# EasyEDA Pro project EasyEDA_Pro_IP5355_ABCC V1.0.epro

# Schematic SCH_IP5355_ABCC V1.0
Create Date: 2024-04-27; Page Name: IP5355; Project Name: IP5355_ABCC V1.0; Schematic Name: SCH_IP5355_ABCC V1.0; Update Date: 2024-05-05; Company: PicoLabs; Drawn: Picomicro; Page Size: A4; Part Number: IP5355_ABCC; Reviewed: Picomicro; Version: V1.0
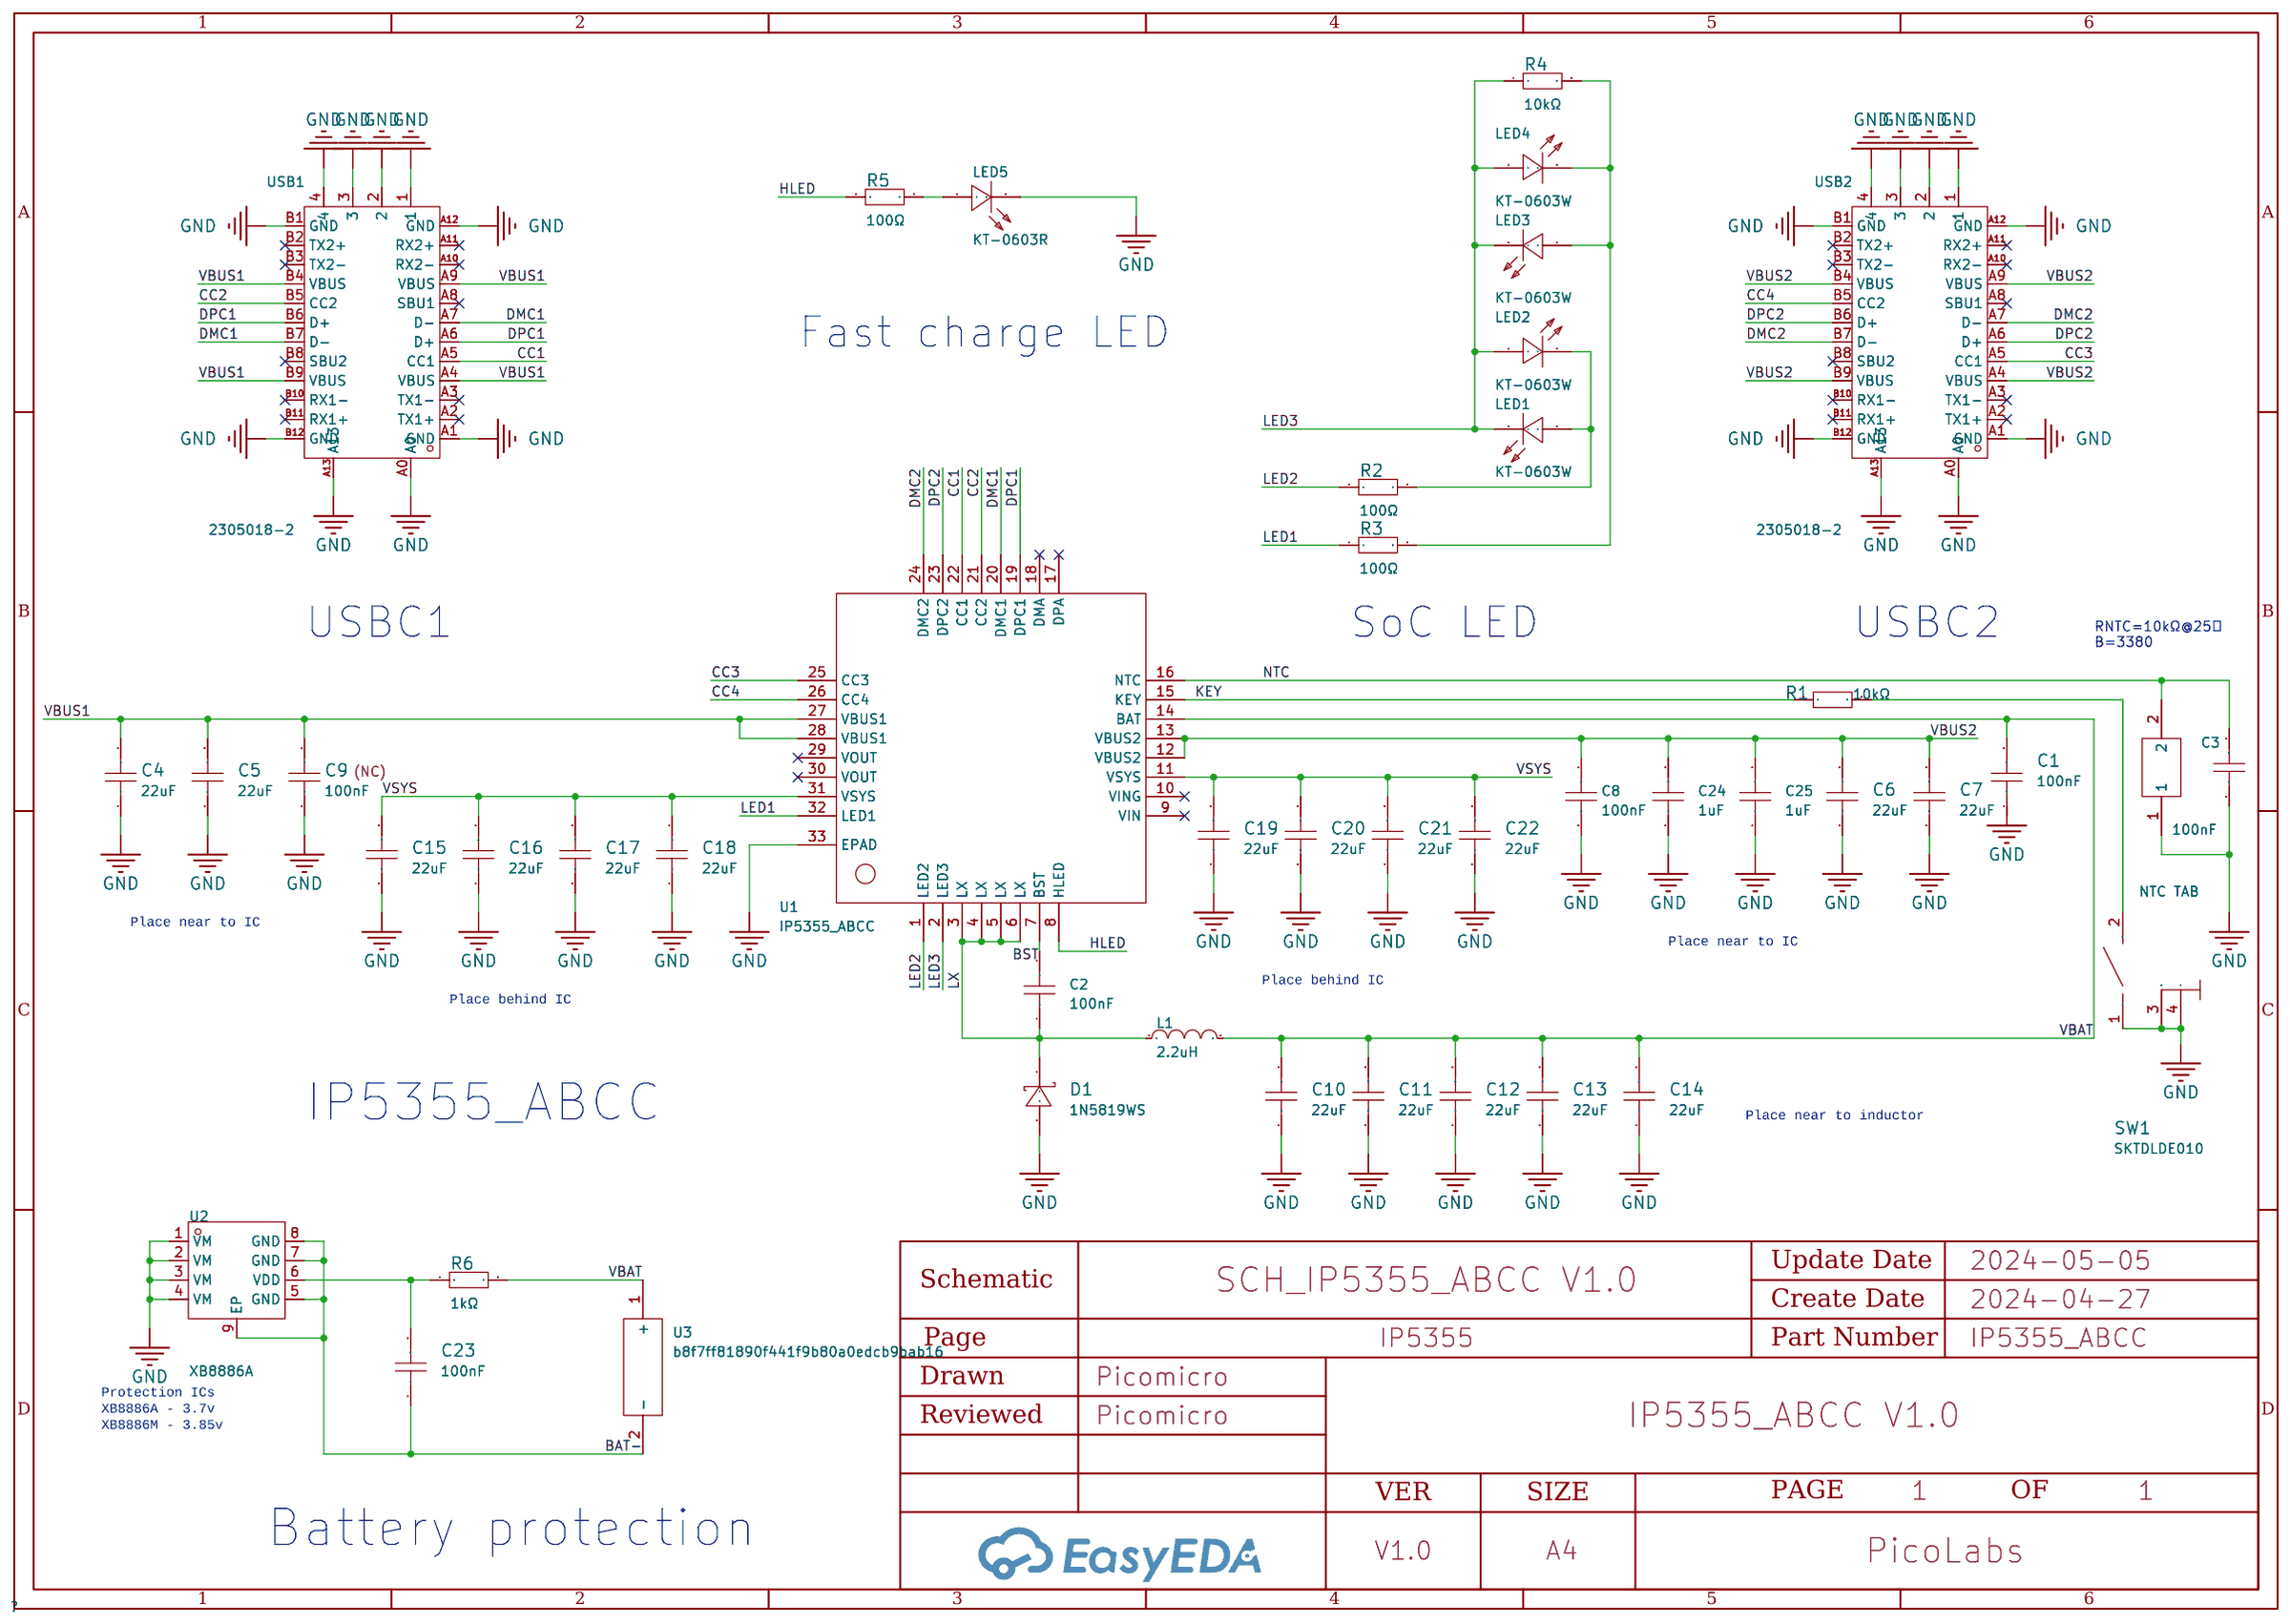
[diagram p0: schematic sheet]

## Parts
C1  100nF  [C0603]
C2  100nF  [C0402]
C3  100nF  [C0402]
C4  22uF  [C0805]
C5  22uF  [C0805]
C6  22uF  [C0805]
C7  22uF  [C0805]
C8  100nF  [C0402]
C9  100nF  [C0402]
C10  22uF  [C0805]
C11  22uF  [C0805]
C12  22uF  [C0805]
C13  22uF  [C0805]
C14  22uF  [C0805]
C15  22uF  [C0805]
C16  22uF  [C0805]
C17  22uF  [C0805]
C18  22uF  [C0805]
C19  22uF  [C0805]
C20  22uF  [C0805]
C21  22uF  [C0805]
C22  22uF  [C0805]
C23  100nF  [C0603]
C24  1uF  [C0402]
C25  1uF  [C0402]
CON1  NTC TAB  [NTC_connector]
D1  1N5819WS  [SOD-323_L1.8-W1.3-LS2.5-RD]
L1  2.2uH  [IND-SMD_L13.5-W12.6_125CDMCC-DS]
LED1  KT-0603W  [LED0603-R-RD_WHITE]
LED2  KT-0603W  [LED0603-R-RD_WHITE]
LED3  KT-0603W  [LED0603-R-RD_WHITE]
LED4  KT-0603W  [LED0603-R-RD_WHITE]
LED5  KT-0603R  [LED0603-RD]
R1  10kΩ  [R0402]
R2  100Ω  [R0402]
R3  100Ω  [R0402]
R4  10kΩ  [R0402]
R5  100Ω  [R0402]
R6  1kΩ  [R0603]
SW1  SKTDLDE010  [KEY-SMD_SKTDLDE010]
U1  IP5355_ABCC  [QFN-32_L5.0-W5.0-P0.50-TL-EP3.5_IP5355]
U2  XB8886A  [SOIC-8_L5.0-W4.0-P1.27-LS6.0-BL-EP2.0]
U3  b8f7ff81890f441f9b80a0edcb9bab16  [9858102 BAT TAB]
USB1  2305018-2  [USB-SMD_2305018-2]
USB2  2305018-2  [USB-SMD_2305018-2]

## Library data of the parts
C1 C23 = CC0603KRX7R9BB104: Capacitance: Tolerance:±10% Tolerance:±10% Voltage Rated: Temperature Coefficient:; LCSC Part Name: 100nF ±10% 50V; Supplier Part: C14663; Manufacturer: YAGEO(国巨); Supplier Footprint: 0603; JLCPCB Part Class: Basic Part; Datasheet: https://atta.szlcsc.com/upload/public/pdf/source/20180910/C282072_33301C7F631E79921B82A8DAC6BCC5B3.pdf; Supplier: LCSC; Tolerance: ±10%
C2 C3 C8 = CL05B104KB54PNC: Capacitance: Tolerance:±10% Tolerance:±10% Voltage Rated: Temperature Coefficient:; LCSC Part Name: 100nF ±10% 50V; Supplier Part: C307331; Manufacturer: SAMSUNG(三星); Supplier Footprint: 0402; JLCPCB Part Class: Basic Part; Datasheet: https://atta.szlcsc.com/upload/public/pdf/source/20160218/1457707763339.pdf; Supplier: LCSC; Tolerance: ±10%
C4-C7 C10-C22 = CL21A226MAQNNNE: Capacitance: Tolerance:±20% Tolerance:±20% Voltage Rated: Temperature Coefficient:; LCSC Part Name: 22uF ±20% 25V; Supplier Part: C45783; Manufacturer: SAMSUNG(三星); Supplier Footprint: 0805; JLCPCB Part Class: Basic Part; Datasheet: https://atta.szlcsc.com/upload/public/pdf/source/20160218/1457707763339.pdf; Supplier: LCSC; Tolerance: ±20%
C9 = CL05B104KB54PNC: Capacitance: Tolerance:±10% Tolerance:±10% Voltage Rated: Temperature Coefficient:; LCSC Part Name: 100nF ±10% 50V; Supplier Part: C307331; Manufacturer: SAMSUNG(三星); Supplier Footprint: 0402; JLCPCB Part Class: Basic Part; Datasheet: https://atta.szlcsc.com/upload/public/pdf/source/20160218/1457707763339.pdf; Supplier: LCSC; Tolerance: ±10%; Note: (NC)
C24 C25 = CL05A105KA5NQNC: Capacitance: Tolerance:±10% Tolerance:±10% Voltage Rated: Temperature Coefficient:; LCSC Part Name: 1uF ±10% 25V; Supplier Part: C52923; Manufacturer: SAMSUNG(三星); Supplier Footprint: 0402; JLCPCB Part Class: Basic Part; Datasheet: https://atta.szlcsc.com/upload/public/pdf/source/20160218/1457707763339.pdf; Supplier: LCSC; Tolerance: ±10%
CON1 = NTC_connector
D1 = 1N5819WS_C191023: Forward Voltage (Vf@If):600mV@1A Reverse Voltage (Vr):40V Average Rectified Current (Io):1A; LCSC Part Name: 电压:40V 电流:1A; Supplier Part: C191023; Manufacturer: Hottech(合科泰); Supplier Footprint: SOD-323; JLCPCB Part Class: Basic Part; Datasheet: https://atta.szlcsc.com/upload/public/pdf/source/20220428/3CB86FD8D28D653594B4E35F9D5AEFD9.pdf; Supplier: LCSC; Forward Voltage (Vf@If): 600mV@1A; Reverse Voltage (Vr): 40V; Average Rectified Current (Io): 1A
L1 = 125CDMCCDS-2R2MC: Inductance: Tolerance:±20% Tolerance:±20% Rated Current: Saturation Current (Isat):34A DC Resistance (DCR): Type:- Ratings:-; LCSC Part Name: 2.2uH ±20% 34A; Supplier Part: C2453932; Manufacturer: Sumida(胜美达); Supplier Footprint: SMD,13.5x12.6mm; JLCPCB Part Class: Extended Part; Datasheet: https://atta.szlcsc.com/upload/public/pdf/source/20210612/404793581B088B31FDAF89ACE8EE802D.pdf; Supplier: LCSC; Tolerance: ±20%; Saturation Current (Isat): 34A
LED1-LED4 = KT-0603W: Emitted Color:White; LCSC Part Name: 0603 白灯 高亮; Supplier Part: C2290; Manufacturer: KENTO; Supplier Footprint: 0603; JLCPCB Part Class: Basic Part; Datasheet: https://atta.szlcsc.com/upload/public/pdf/source/20221101/4C23D5C85BA051E44A00B833D0A41468.pdf; Supplier: LCSC; Emitted Color: White
LED5 = KT-0603R: Emitted Color:Red Power Dissipation:- Forward Current:- Dominant Wavelength:- Dominant Wavelength:- Peak Wavelength:- Diode Configuration:- Lens Color:- Color Temperature:- Color Temperature:- Viewing Angle:- Mounting Sytle:- Operating Temperature:-40℃~+8; LCSC Part Name: 0603 红灯 高亮; Supplier Part: C2286; Manufacturer: KENTO; Supplier Footprint: 0603; JLCPCB Part Class: Basic Part; Datasheet: https://atta.szlcsc.com/upload/public/pdf/source/20160616/1466072038404.pdf; Supplier: LCSC; Emitted Color: Red; Operating Temperature: -40℃~+85℃
R1 R4 = 0402WGF1002TCE: Type:Thick Film Resistors Resistance:10kΩ Tolerance:±1% Tolerance:±1% Power(Watts): Overload Voltage (Max): Temperature Coefficient:±100ppm/℃ Temperature Coefficient:±100ppm/℃ Operating Temperature Range:-55℃~+155℃ Operating Temperature Range:-55℃~+155℃; LCSC Part Name: 10kΩ ±1% 62.5mW 厚膜电阻; Supplier Part: C25744; Manufacturer: UNI-ROYAL(厚声); Supplier Footprint: 0402; JLCPCB Part Class: Basic Part; Datasheet: https://atta.szlcsc.com/upload/public/pdf/source/20200306/C422600_1E6D84923E4A46A82E41ADD87F860B5C.pdf; Supplier: LCSC; Type: Thick Film Resistors; Tolerance: ±1%; Temperature Coefficient: ±100ppm/℃; Operating Temperature Range: -55℃~+155℃
R2 R3 R5 = 0402WGF1000TCE: Type:Thick Film Resistors Resistance: Tolerance:±1% Tolerance:±1% Power(Watts): Overload Voltage (Max): Temperature Coefficient:±200ppm/℃ Temperature Coefficient:±200ppm/℃ Operating Temperature Range:-55℃~+155℃ Operating Temperature Range:-55℃~+155℃; LCSC Part Name: 100Ω ±1% 62.5mW 厚膜电阻; Supplier Part: C25076; Manufacturer: UNI-ROYAL(厚声); Supplier Footprint: 0402; JLCPCB Part Class: Basic Part; Datasheet: https://atta.szlcsc.com/upload/public/pdf/source/20200306/C422600_1E6D84923E4A46A82E41ADD87F860B5C.pdf; Supplier: LCSC; Type: Thick Film Resistors; Tolerance: ±1%; Temperature Coefficient: ±200ppm/℃; Operating Temperature Range: -55℃~+155℃
R6 = 0603WAF1001T5E: Type:Thick Film Resistors Resistance:1kΩ Tolerance:±1% Tolerance:±1% Power(Watts): Overload Voltage (Max): Temperature Coefficient:±100ppm/℃ Temperature Coefficient:±100ppm/℃ Operating Temperature Range:-55℃~+155℃ Operating Temperature Range:-55℃~+155℃; LCSC Part Name: 1kΩ ±1% 100mW 厚膜电阻; Supplier Part: C21190; Manufacturer: UNI-ROYAL(厚声); Supplier Footprint: 0603; JLCPCB Part Class: Basic Part; Datasheet: https://atta.szlcsc.com/upload/public/pdf/source/20200306/C422600_1E6D84923E4A46A82E41ADD87F860B5C.pdf; Supplier: LCSC; Type: Thick Film Resistors; Tolerance: ±1%; Temperature Coefficient: ±100ppm/℃; Operating Temperature Range: -55℃~+155℃
SW1 = SKTDLDE010: Circuit:SPST Actuator Style:Rectangle button Mounting Style:Lying Switch Length:3.9mm Switch Width:2.9mm Switch Height:1.55mm Contact Current:50mA Voltage Rating (DC):12V With Lamp:- Mechanical Life:-; LCSC Part Name: 3.9*2.9*1.55mm 卧插 轻触开关; Supplier Part: C115365; Manufacturer: ALPSALPINE(阿尔卑斯阿尔派); Supplier Footprint: 插件; JLCPCB Part Class: Extended Part; Datasheet: https://atta.szlcsc.com/upload/public/pdf/source/20170620/1497944818446.pdf; Supplier: LCSC; Circuit: SPST; Actuator Style: Rectangle button; Mounting Style: Lying; Switch Length: 3.9mm; Switch Width: 2.9mm; Switch Height: 1.55mm; Contact Current: 50mA; Voltage Rating (DC): 12V
U1 = IP5355_ABCC: Supplier: LCSC; Supplier Part: C9900092436; JLCPCB Part Class: Extended Part
U2 = XB8886A: Supplier Part: C669690; Manufacturer: xysemi(赛芯微); Supplier Footprint: SOIC-8-EP; JLCPCB Part Class: Extended Part; Datasheet: https://atta.szlcsc.com/upload/public/pdf/source/20200622/C669690_0063EAE3A52CEE4F89E3070819BC465F.pdf; Supplier: LCSC
U3 = 9858102 BAT TAB
USB1 USB2 = 2305018-2: Connector Type:Type-C Standard:USB 3.2 Gender:Female Number of Ports:1 Number of Contacts:24P Mounting Style:卧贴 Current Rating - Power (Max):- Operating Temperature Range:-40℃~+85℃ Operating Temperature Range:-40℃~+85℃; LCSC Part Name: Type-C 母 卧贴; Supplier Part: C498674; Manufacturer: TE Connectivity(泰科电子); Supplier Footprint: SMD; JLCPCB Part Class: Extended Part; Datasheet: https://atta.szlcsc.com/upload/public/pdf/source/20211230/A35CFB568880C0409940BD32CE432EFF.pdf; Supplier: LCSC; Connector Type: Type-C; Standard: USB 3.2; Gender: Female; Number of Ports: 1; Number of Contacts: 24P; Mounting Style: 卧贴; Operating Temperature Range: -40℃~+85℃

## Nets
GND: C1.1 C3.2 C4.1 C5.1 C6.1 C7.1 C8.2 C9.2 C10.1 C11.1 C12.1 C13.1 C14.1 C15.1 C16.1 C17.1 C18.1 C19.1 C20.1 C21.1 C22.1 C24.1 C25.1 CON1.1 D1.2(A) LED5.1(K) SW1.1 SW1.3 SW1.4 U1.33(EPAD) U2.1(VM) U2.2(VM) U2.3(VM) U2.4(VM) USB1.1 USB1.2 USB1.3 USB1.4 USB1.A0 USB1.A1(GND) USB1.A12(GND) USB1.A13 USB1.B1(GND) USB1.B12(GND) USB2.1 USB2.2 USB2.3 USB2.4 USB2.A0 USB2.A1(GND) USB2.A12(GND) USB2.A13 USB2.B1(GND) USB2.B12(GND)
VBAT: C1.2 C10.2 C11.2 C12.2 C13.2 C14.2 L1.2 R6.2 U1.14(BAT) U3.1(+)
VBUS1: C4.2 C5.2 C9.1 U1.27(VBUS1) U1.28(VBUS1) USB1.A4(VBUS) USB1.A9(VBUS) USB1.B4(VBUS) USB1.B9(VBUS)
VBUS2: C6.2 C7.2 C8.1 C24.2 C25.2 U1.12(VBUS2) U1.13(VBUS2) USB2.A4(VBUS) USB2.A9(VBUS) USB2.B4(VBUS) USB2.B9(VBUS)
BAT-: C23.1 U2.5(GND) U2.7(GND) U2.8(GND) U2.9(EP) U3.2(-)
BST: C2.2 U1.7(BST)
CC1: U1.22(CC1) USB1.A5(CC1)
CC2: U1.21(CC2) USB1.B5(CC2)
CC3: U1.25(CC3) USB2.A5(CC1)
CC4: U1.26(CC4) USB2.B5(CC2)
DMC1: U1.20(DMC1) USB1.A7(D-) USB1.B7(D-)
DMC2: U1.24(DMC2) USB2.A7(D-) USB2.B7(D-)
DPC1: U1.19(DPC1) USB1.A6(D+) USB1.B6(D+)
DPC2: U1.23(DPC2) USB2.A6(D+) USB2.B6(D+)
HLED: R5.1 U1.8(HLED)
KEY: R1.1 U1.15(KEY)
LED1: R3.1 U1.32(LED1)
LED2: R2.1 U1.1(LED2)
LED3: LED1.2(K) LED2.1(A) LED3.2(K) LED4.1(A) R4.1 U1.2(LED3)
LX: C2.1 D1.1(K) L1.1 U1.3(LX) U1.4(LX) U1.5(LX) U1.6(LX)
NTC: C3.1 CON1.2 U1.16(NTC)
VSYS: C15.2 C16.2 C17.2 C18.2 C19.2 C20.2 C21.2 C22.2 U1.11(VSYS) U1.31(VSYS)
$1N4792: R1.2 SW1.2
$1N5160: LED1.1(A) LED2.2(K) R2.2
$1N5318: LED3.1(A) LED4.2(K) R3.2 R4.2
$1N5487: C23.2 R6.1 U2.6(VDD)
$1N6588: LED5.2(A) R5.2

Not connected (* = marked no-connect by the designer): U1 9(VIN)* 10(VING)* 17(DPA)* 18(DMA)* 29(VOUT)* 30(VOUT)*; USB1 A2(TX1+)* A3(TX1-)* A8(SBU1)* A10(RX2-)* A11(RX2+)* B2(TX2+)* B3(TX2-)* B8(SBU2)* B10(RX1-)* B11(RX1+)*; USB2 A2(TX1+)* A3(TX1-)* A8(SBU1)* A10(RX2-)* A11(RX2+)* B2(TX2+)* B3(TX2-)* B8(SBU2)* B10(RX1-)* B11(RX1+)*

## Notes on the sheet
- Fast charge LED
- USBC1
- SoC LED
- USBC2
- RNTC=10kΩ@25℃
  B=3380
- Place near to IC
- Place near to IC
- Place behind IC
- Place behind IC
- IP5355_ABCC
- Place near to inductor
- Protection ICs
  XB8886A - 3.7v
  XB8886M - 3.85v
- Battery protection

# Board PCB_IP5355_ABCC V1.0
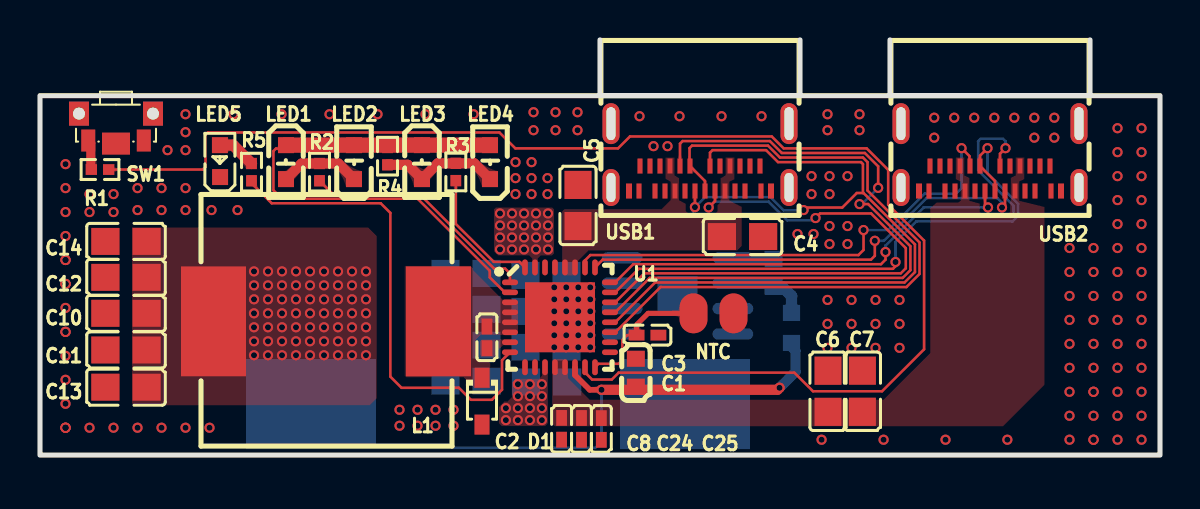
[diagram p1: board, top side]
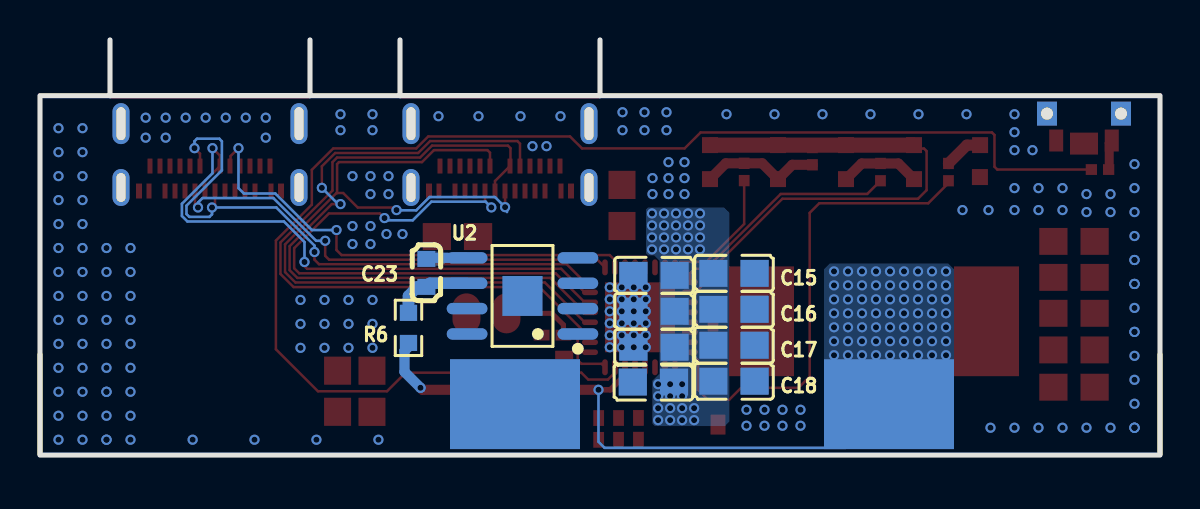
[diagram p2: board, bottom side, seen from below]

Outline 56 x 20.79 mm; copper layers: Top Layer, Inner1, Inner2, Bottom Layer. Coordinates in mm from the lower left corner of the outline.
Outline path: rectangle 0,18 56,0
Stack: Top Layer 0.035mm 外层铜厚1oz / Dielectric1 0.2104mm 7628 RC49% 8.6mil / Inner1 0.0152mm 内层铜厚 / Dielectric2 1.065mm 1.1mm H/HOZ 含铜 / Inner2 0.0152mm 内层铜厚 / Dielectric3 0.2104mm 7628 RC49% 8.6mil / Bottom Layer 0.035mm 外层铜厚1oz

## Design rules (mm)
template: Custom Config
spacing copperThickness1oz (default): track to track 0.102, other pairs 0.152 to 0.3
spacing copperThickness2oz: track to track 0.203, other pairs 0.152 to 0.3
track width copperThickness1oz (default): min 0.127, default 0.254, max 2.54
track width copperThickness2oz: min 0.203, default 0.254, max 2.54
differential pair differentialPair (default): width min 0.127, default 0.254, max 2.54; gap min 0.152, default 0.152
via viaSize (default): diameter min 0.5, default 0.61, max 10; hole min 0.3, default 0.305, max 6.3

## Placement (name value [footprint] x y rotation side)
C1  100nF  [C0603]  29.79 4.12 270 top
C2  100nF  [C0402]  22.34 5.9 270 top
C3  100nF  [C0402]  30.37 6.01 0 top
C4  22uF  [C0805]  35.13 10.94 180 top
C5  22uF  [C0805]  26.9 12.5 270 top
C6  22uF  [C0805]  39.4 3.19 270 top
C7  22uF  [C0805]  41.12 3.2 270 top
C8  100nF  [C0402]  26.08 1.32 270 top
C10  22uF  [C0805]  4.3 7.1 0 top
C11  22uF  [C0805]  4.3 5.27 0 top
C12  22uF  [C0805]  4.3 8.9 0 top
C13  22uF  [C0805]  4.3 3.4 0 top
C14  22uF  [C0805]  4.3 10.7 0 top
C15  22uF  [C0805]  21.3 9.1 0 bottom
C16  22uF  [C0805]  21.3 7.3 0 bottom
C17  22uF  [C0805]  21.3 5.5 0 bottom
C18  22uF  [C0805]  21.3 3.7 0 bottom
C19  22uF  [C0805]  25.33 3.66 180 bottom
C20  22uF  [C0805]  25.3 5.4 180 bottom
C21  22uF  [C0805]  25.3 7.2 180 bottom
C22  22uF  [C0805]  25.3 9 180 bottom
C23  100nF  [C0603]  36.68 9.12 270 bottom
C24  1uF  [C0402]  27.07 1.31 90 top
C25  1uF  [C0402]  28.07 1.31 90 top
D1  1N5819WS  [SOD-323_L1.8-W1.3-LS2.5-RD]  22.1 2.7 270 top
L1  2.2uH  [IND-SMD_L13.5-W12.6_125CDMCC-DS]  14.3 6.7 180 top
LED1  KT-0603W  [LED0603-R-RD_WHITE]  12.3 14.67 270 top
LED2  KT-0603W  [LED0603-R-RD_WHITE]  15.7 14.67 90 top
LED3  KT-0603W  [LED0603-R-RD_WHITE]  19.1 14.67 270 top
LED4  KT-0603W  [LED0603-R-RD_WHITE]  22.5 14.67 90 top
LED5  KT-0603R  [LED0603-RD]  9 14.72 90 top
NTC  NTC TAB  [NTC_connector]  33.68 7.1 180 top
R1  10kΩ  [R0402]  3 14.3 180 top
R2  100Ω  [R0402]  13.98 14.17 90 top
R3  100Ω  [R0402]  20.79 14.18 90 top
R4  10kΩ  [R0402]  17.38 14.97 270 top
R5  100Ω  [R0402]  10.58 14.17 90 top
R6  1kΩ  [R0603]  37.58 6.37 270 bottom
SW1  SKTDLDE010  [KEY-SMD_SKTDLDE010]  3.8 16.35 0 top
U1  IP5355_ABCC  [QFN-32_L5.0-W5.0-P0.50-TL-EP3.5_IP5355]  26 6.9 0 top
U2  XB8886A  [SOIC-8_L5.0-W4.0-P1.27-LS6.0-BL-EP2.0]  31.88 7.97 90 bottom
U3  b8f7ff81890f441f9b80a0edcb9bab16  [9858102 BAT TAB]  56 2.55 180 bottom
USB1  2305018-2  [USB-SMD_2305018-2]  33 14.91 180 top
USB2  2305018-2  [USB-SMD_2305018-2]  47.5 14.91 180 top

## Footprints (pads in the part's own frame, mm; a bottom-side part is the same pattern mirrored in y, then rotated)
9858102 BAT TAB
  rect 6.5x4.5 smd: 1(42.45,0) 2(23.75,0)
C0402
  rect 0.79x0.54 smd: 1(-0.545,0) 2(0.545,0)
C0603
  rect 0.8x0.9 smd: 1(-0.7,0) 2(0.7,0)
C0805
  rect 1.41x1.35 smd: 1(-1.03,0) 2(1.03,0)
IND-SMD_L13.5-W12.6_125CDMCC-DS
  rect 3.25x5.5 smd: 1(-5.625,0) 2(5.625,0)
KEY-SMD_SKTDLDE010
  rect 0.7x1.1 smd: 1(1.391,-0.597) 2(-1.388,-0.597)
  rect 1.4x1.1 smd: 3(0,-0.75)
  rect 1x1.2 hole 0.6: 4(-1.85,0.75) 4(1.85,0.75)
LED0603-R-RD_WHITE
  rect 0.8x0.8 smd: 1(0.851,0) 2(-0.851,0)
LED0603-RD
  rect 0.8x0.8 smd: 1(-0.799,-0.004) 2(0.799,0.004)
NTC_connector
  oval 1.4x2 smd: 1(-1,0) 2(1,0)
QFN-32_L5.0-W5.0-P0.50-TL-EP3.5_IP5355
  oval 0.8x0.28 smd: 1(-2.5,1.75) 2(-2.5,1.25) 3(-2.5,0.75) 4(-2.5,0.25) 5(-2.5,-0.25) 6(-2.5,-0.75) 7(-2.5,-1.25) 8(-2.5,-1.75) 17(2.5,-1.75) 18(2.5,-1.25) 19(2.5,-0.75) 20(2.5,-0.25) 21(2.5,0.25) 22(2.5,0.75) 23(2.5,1.25) 24(2.5,1.75)
  oval 0.28x0.8 smd: 9(-1.75,-2.5) 10(-1.25,-2.5) 11(-0.75,-2.5) 12(-0.25,-2.5) 13(0.25,-2.5) 14(0.75,-2.5) 15(1.25,-2.5) 16(1.75,-2.5) 25(1.75,2.5) 26(1.25,2.5) 27(0.75,2.5) 28(0.25,2.5) 29(-0.25,2.5) 30(-0.75,2.5) 31(-1.25,2.5) 32(-1.75,2.5)
  rect 3.5x3.5 smd: 33(0,0)
R0402
  rect 0.566x0.54 smd: 1(-0.433,0) 2(0.433,0)
R0603
  rect 0.806x0.864 smd: 1(-0.753,0) 2(0.753,0)
SOD-323_L1.8-W1.3-LS2.5-RD
  rect 1x0.75 smd: 1(-1.173,0) 2(1.173,0)
SOIC-8_L5.0-W4.0-P1.27-LS6.0-BL-EP2.0
  oval 0.574x2.038 smd: 1(-1.905,-2.769) 2(-0.635,-2.769) 3(0.635,-2.769) 4(1.905,-2.769) 5(1.905,2.769) 6(0.635,2.769) 7(-0.635,2.769) 8(-1.905,2.769)
  rect 2x2 smd: 9(0,0)
USB-SMD_2305018-2
  oval 0.85x1.85 hole 0.45x1.45: 1(-4.45,1.512) 2(4.45,1.512)
  oval 0.85x2.05 hole 0.45x1.65: 3(-4.45,-1.688) 4(4.45,-1.687)
  rect 0.3x0.75 smd: A0(-3.55,1.688) A13(3.55,1.688)
  rect 0.25x0.75 smd: A1(-3.05,1.688) A2(-2.25,1.688) A3(-1.75,1.688) A4(-1.25,1.688) A5(-0.75,1.688) A6(-0.25,1.688) A7(0.25,1.688) A8(0.75,1.688) A9(1.25,1.688) A10(1.75,1.688) A11(2.25,1.688) A12(3.05,1.688) B1(3,0.438) B2(2.5,0.438) B3(2,0.438) B4(1.5,0.438) B5(1,0.438) B6(0.5,0.438) B7(-0.5,0.438) B8(-1,0.438) B9(-1.5,0.438) B10(-2,0.438) B11(-2.5,0.438) B12(-3,0.438)

## Nets
As in the schematic, except:
GND: C1.1 C3.2 C4.1 C5.1 C6.1 C7.1 C8.2 C10.1 C11.1 C12.1 C13.1 C14.1 C15.1 C16.1 C17.1 C18.1 C19.1 C20.1 C21.1 C22.1 C24.1 C25.1 D1.2 LED5.1 NTC.1 SW1.1 SW1.3 SW1.4 U1.33 U2.1 U2.2 U2.3 U2.4 USB1.1 USB1.2 USB1.3 USB1.4 USB1.A0 USB1.A1 USB1.A12 USB1.A13 USB1.B1 USB1.B12 USB2.1 USB2.2 USB2.3 USB2.4 USB2.A0 USB2.A1 USB2.A12 USB2.A13 USB2.B1 USB2.B12
NTC: C3.1 NTC.2 U1.16

Pads without a net: U1 9 10 17 18 29 30; USB1 A2 A3 A8 A10 A11 B2 B3 B8 B10 B11; USB2 A2 A3 A8 A10 A11 B2 B3 B8 B10 B11

## Via types
v1: diameter 0.51, hole 0.305, Top Layer to Bottom Layer, 301 vias

## Routing (per net, layer and track width the routed paths; a pad name or vN(x,y) marks a point on that pad's centre or on a via; arc(x,y) is an arc through that point)
GND:
  vias: v1(1.28,14.57) v1(1.28,13.37) v1(1.28,12.17) v1(1.28,10.97) v1(1.28,9.77) v1(1.28,9.77) v1(1.28,8.57) v1(1.28,8.57) v1(1.28,8.57) v1(1.28,7.37) v1(1.28,6.17) v1(1.28,6.17) v1(1.28,4.97) v1(1.28,3.77) v1(1.28,2.57) v1(1.28,1.37) v1(1.28,1.37) v1(1.28,1.37) v1(2.48,13.07) v1(2.48,12.17) v1(2.48,1.37) v1(3.68,13.07) v1(3.68,12.17) v1(3.68,1.37) v1(4.88,13.37) v1(4.88,12.27) v1(4.88,1.37) v1(6.08,13.37) v1(6.08,12.27) v1(6.08,1.37) v1(6.38,15.27) v1(7.28,17.07) v1(7.28,16.17) v1(7.28,15.27) v1(7.28,13.37) v1(7.28,12.27) v1(7.28,1.37) v1(8.48,1.37) v1(8.58,12.27) v1(9.68,17.07) v1(9.88,12.27) v1(12.08,17.07) v1(14.48,17.07) v1(16.88,17.07) v1(17.98,2.27) v1(17.98,1.47) v1(18.88,2.27) v1(18.88,1.47) v1(19.28,17.07) v1(19.78,2.27) v1(19.78,1.47) v1(20.68,2.27) v1(20.68,1.47) v1(21.68,17.07) v1(23.78,14.67) v1(23.78,13.87) v1(23.78,13.07) v1(24.58,14.67) v1(24.58,13.87) v1(24.58,13.07) v1(24.68,17.17) v1(24.68,16.27) v1(25.38,13.87) v1(25.38,13.07) v1(25.71,8.4) v1(25.71,7.8) v1(25.71,7.2) v1(25.71,6.6) v1(25.71,6) v1(25.71,5.4) v1(25.78,17.17) v1(25.78,16.27) v1(26.31,8.4) v1(26.31,7.8) v1(26.31,7.2) v1(26.31,6.6) v1(26.31,6) v1(26.31,5.4) v1(26.88,17.17) v1(26.88,16.27) v1(26.91,8.4) v1(26.91,7.8) v1(26.91,7.2) v1(26.91,6.6) v1(26.91,6) v1(26.91,5.4) v1(27.51,8.4) v1(27.51,7.8) v1(27.51,7.2) v1(27.51,6.6) v1(27.51,6) v1(27.51,5.4) v1(29.98,16.97) v1(30.68,15.47) v1(31.38,15.47) v1(31.98,16.97) v1(34.08,16.97) v1(36.08,16.97) v1(37.88,11.07) v1(38.58,13.97) v1(38.58,13.07) v1(38.68,11.07) v1(39.08,0.77) v1(39.38,17.07) v1(39.38,16.27) v1(39.38,7.77) v1(39.38,6.57) v1(39.38,5.37) v1(39.48,13.97) v1(39.48,13.07) v1(39.48,11.47) v1(39.48,10.57) v1(40.38,13.97) v1(40.38,11.47) v1(40.38,10.57) v1(40.58,7.77) v1(40.58,6.57) v1(40.58,5.37) v1(40.98,17.07) v1(40.98,16.27) v1(41.78,7.77) v1(41.78,6.57) v1(41.78,5.37) v1(42.18,0.77) v1(42.98,7.77) v1(42.98,6.57) v1(42.98,5.37) v1(44.71,16.9) v1(44.71,15.9) v1(45.28,0.77) v1(45.71,16.9) v1(46.71,16.9) v1(47.72,16.9) v1(48.37,0.77) v1(48.72,16.9) v1(49.72,16.9) v1(49.72,15.9) v1(50.72,16.9) v1(50.72,15.9) v1(51.48,10.37) v1(51.48,9.17) v1(51.48,7.97) v1(51.48,6.77) v1(51.48,5.57) v1(51.48,4.37) v1(51.48,3.17) v1(51.48,1.97) v1(51.48,0.77) v1(52.68,10.37) v1(52.68,9.17) v1(52.68,7.97) v1(52.68,6.77) v1(52.68,5.57) v1(52.68,4.37) v1(52.68,3.17) v1(52.68,3.17) v1(52.68,1.97) v1(52.68,0.77) v1(52.68,0.77) v1(53.88,16.37) v1(53.88,15.17) v1(53.88,13.97) v1(53.88,12.77) v1(53.88,11.57) v1(53.88,10.37) v1(53.88,9.17) v1(53.88,7.97) v1(53.88,6.77) v1(53.88,5.57) v1(53.88,4.37) v1(53.88,3.17) v1(53.88,1.97) v1(53.88,0.77) v1(55.08,16.37) v1(55.08,15.17) v1(55.08,13.97) v1(55.08,12.77) v1(55.08,11.57) v1(55.08,10.37) v1(55.08,9.17) v1(55.08,7.97) v1(55.08,6.77) v1(55.08,5.57) v1(55.08,4.37) v1(55.08,3.17) v1(55.08,1.97) v1(55.08,0.77)
VBAT: length 31.7
  Top Layer w0.28: U1.14 26.75,4 27.49,3.27 v1(28.08,3.27)
  Top Layer w0.508: v1(36.98,3.37) 36.88,3.27 v1(28.08,3.27)
  Bottom Layer w0.127: v1(28.08,3.27) 28.08,0.67 27.77,0.36 15.74,0.36 U3.1
  Bottom Layer w0.508: 37.48,5.52 37.78,5.22 37.78,4.17 v1(36.98,3.37)
  vias: v1(10.7,9.2) v1(10.7,8.5) v1(10.7,7.8) v1(10.7,7.1) v1(10.7,6.4) v1(10.7,5.7) v1(10.7,5) v1(11.4,9.2) v1(11.4,8.5) v1(11.4,7.8) v1(11.4,7.1) v1(11.4,6.4) v1(11.4,5.7) v1(11.4,5) v1(12.1,9.2) v1(12.1,8.5) v1(12.1,7.8) v1(12.1,7.1) v1(12.1,6.4) v1(12.1,5.7) v1(12.1,5) v1(12.8,9.2) v1(12.8,8.5) v1(12.8,7.8) v1(12.8,7.1) v1(12.8,6.4) v1(12.8,5.7) v1(12.8,5) v1(13.5,9.2) v1(13.5,8.5) v1(13.5,7.8) v1(13.5,7.1) v1(13.5,6.4) v1(13.5,5.7) v1(13.5,5) v1(14.2,9.2) v1(14.2,8.5) v1(14.2,7.8) v1(14.2,7.1) v1(14.2,6.4) v1(14.2,5.7) v1(14.2,5) v1(14.9,9.2) v1(14.9,8.5) v1(14.9,7.8) v1(14.9,7.1) v1(14.9,6.4) v1(14.9,5.7) v1(14.9,5) v1(15.6,9.2) v1(15.6,8.5) v1(15.6,7.8) v1(15.6,7.1) v1(15.6,6.4) v1(15.6,5.7) v1(15.6,5) v1(16.3,9.2) v1(16.3,8.5) v1(16.3,7.8) v1(16.3,7.1) v1(16.3,6.4) v1(16.3,5.7) v1(16.3,5)
VBUS1: length 0.3
  Top Layer w0.127: C5.2 26.69,11.69
BAT-: length 2.1
  Bottom Layer w0.508: 36.68,9.77 36.57,9.88 U2.5
CC1: length 28.7
  Top Layer w0.127: v1(33.43,12.4) 33.75,12.72 USB1.A5 ; v1(38.78,11.87) 39,12.1 41.56,12.1 43.29,10.36 43.29,9.35 43.04,9.1 30.22,9.1 28.76,7.65 U1.22
  Bottom Layer w0.127: v1(38.78,11.87) 38.66,11.76 37.36,11.76 36.43,12.69 33.72,12.69 v1(33.43,12.4)
CC2: length 34.5
  Top Layer w0.127: U1.21 28.76,7.15 30.49,8.87 43.13,8.87 43.52,9.26 43.52,10.46 41.41,12.57 v1(40.98,12.57) ; USB1.B5 32,15.59 32.13,15.73 36.49,15.73 37.09,15.13 41.24,15.13 41.91,14.46 v1(41.91,13.38)
  Bottom Layer w0.127: v1(41.91,13.38) 41.09,12.57 v1(40.98,12.57)
CC3: length 23.5
  Top Layer w0.127: U1.25 28.14,9.79 41.55,9.79 41.74,9.98 v1(41.74,10.73) ; v1(48.1,12.4) 48.25,12.55 USB2.A5
  Bottom Layer w0.127: v1(48.1,12.4) 48.1,12.65 47.88,12.87 44.33,12.87 42.19,10.73 v1(41.74,10.73)
CC4: length 24.1
  Top Layer w0.127: 46.47,14.68 46.47,14.97 v1(46.08,15.37) ; v1(41.18,11.27) 41.18,10.27 40.92,10.02 27.52,10.02 27.25,9.75 U1.26
  Bottom Layer w0.127: v1(46.08,15.37) 46.08,13.37 45.8,13.1 44.23,13.1 42.41,11.27 v1(41.18,11.27)
DMC1: length 41.8
  Top Layer w0.127: USB1.B7 33.5,15.14 33.63,15.27 36.3,15.27 36.9,14.67 41.05,14.67 41.15,14.58 41.15,13.12 ; v1(32.75,12.42) 32.75,13.22 USB1.A7 ; 41.15,13.12 41.18,13.12 43.75,10.55 43.75,9.16 43.23,8.64 30.76,8.64 28.76,6.65 U1.20 ; 41.15,13.12 40.84,13.12 40.11,12.4 38.3,12.4 v1(38.18,12.27)
  Bottom Layer w0.127: 32.65,12.17 32.65,12.32 v1(32.75,12.42) 33.25,12.92 36.52,12.92 37.18,12.26 38.16,12.26 v1(38.18,12.27)
DMC2: length 30.7
  Top Layer w0.127: USB2.A7 47.25,12.55 v1(47.4,12.4) ; U1.24 28.76,8.65 29.66,9.56 42.05,9.56 42.28,9.79 v1(42.28,10.17) ; USB2.B7 48,15.09 v1(48.28,15.37)
  Bottom Layer w0.127: v1(48.28,15.37) 48.28,15.72 48.15,15.84 47.03,15.84 46.91,15.71 46.91,14.26 48.68,12.49 48.68,12.07 48.53,11.93 47.53,11.93 47.4,12.06 v1(47.4,12.4) 44.18,12.4 42.28,10.49 v1(42.28,10.17)
DPC1: length 35.3
  Top Layer w0.127: USB1.A6 33.25,13.72 USB1.B6 ; 32.49,14.35 32.48,14.36 32.48,15.37 32.6,15.5 36.4,15.5 37,14.9 41.15,14.9 41.38,14.67 41.38,13.25 43.98,10.65 43.98,9.07 43.32,8.42 31.03,8.42 28.76,6.15 U1.19
DPC2: length 29.2
  Top Layer w0.127: 47,14.64 47,14.99 v1(47.38,15.37) ; USB2.B6 47.75,13.72 USB2.A6 ; v1(42.78,9.67) 42.78,9.46 42.65,9.33 29.94,9.33 28.76,8.15 U1.23
  Bottom Layer w0.127: v1(47.38,15.37) 47.38,14.11 48.9,12.58 48.9,11.97 48.63,11.7 43.81,11.7 42.78,10.67 v1(42.78,9.67)
HLED: length 24.2
  Top Layer w0.127: U1.8 23.1,4.75 23.1,3.27 22.6,2.77 21.54,2.77 20.94,3.37 18.08,3.37 17.52,3.93 17.52,12.13 17.04,12.61 11.59,12.61 10.58,13.62 R5.1
KEY: length 70.4
  Top Layer w0.127: U1.15 27.25,4.14 27.6,3.78 28.59,3.78 28.93,4.13 37.72,4.13 38.65,3.2 42.1,3.2 44.2,5.3 44.2,10.74 42.41,12.54 42.41,14.28 41.33,15.36 37.18,15.36 36.59,15.96 29.5,15.96 28.9,15.36 23.77,15.36 22.97,16.16 8.4,16.16 8.28,16.03 8.28,14.44 8.14,14.3 R1.1
LED1: length 6.5
  Top Layer w0.127: U1.32 23.97,9.67 22.69,9.67 20.79,11.57 R3.1
LED2: length 11.9
  Top Layer w0.127: U1.1 23.5,9.1 23.25,9.34 22.7,9.34 18.96,13.08 14.64,13.08 R2.1
LED3: length 27.1
  Top Layer w0.127: LED1.2 12.13,15.35 11.8,15.35 11.67,15.22 11.67,13.27 12.1,12.84 18.88,12.84 22.49,9.23 22.49,8.9 23.24,8.15 U1.2
  Top Layer w0.76: LED4.1 LED3.2 LED2.1 LED1.2
NTC: length 6.6
  Top Layer w0.127: C3.1 29.36,6.01 29.12,5.77 29.12,4.76 28.93,4.57 27.92,4.57 U1.16
  Top Layer w0.254: 32.38,7.1 30.4,7.1 29.83,6.52 C3.1
VSYS:
  vias: v1(23,12.1) v1(23,11.5) v1(23,10.9) v1(23,10.3) v1(23.29,2.35) v1(23.29,1.75) v1(23.6,12.1) v1(23.6,11.5) v1(23.6,10.9) v1(23.6,10.3) v1(23.89,3.55) v1(23.89,2.95) v1(23.89,2.35) v1(23.89,1.75) v1(24.2,12.1) v1(24.2,11.5) v1(24.2,10.9) v1(24.2,10.3) v1(24.49,3.55) v1(24.49,2.95) v1(24.49,2.35) v1(24.49,1.75) v1(24.8,12.1) v1(24.8,11.5) v1(24.8,10.9) v1(24.8,10.3) v1(25.09,3.55) v1(25.09,2.95) v1(25.09,2.35) v1(25.09,1.75) v1(25.4,12.1) v1(25.4,11.5) v1(25.4,10.9) v1(25.4,10.3)
$1N4792: length 1.5
  Top Layer w0.45: R1.2 2.54,14.33 2.54,15.63 SW1.2
$1N5160: length 4
  Top Layer w0.51: LED2.2 14.92,14.6 13.08,14.6 LED1.1
$1N5318: length 6.1
  Top Layer w0.51: R4.2 18.38,14.54 LED3.1 19.89,14.61 21.71,14.61 LED4.2
$1N5487: length 4
  Bottom Layer w0.572: U2.6 36.5,8.61 C23.2 37.12,8.42 37.58,7.97 R6.1
$1N6588: length 2
  Top Layer w0.559: LED5.2 9.66,15.52 10.58,14.6

## Copper pours and planes (outline as drawn; the poured copper is in the pictures)
GND on Top Layer: -32.5,31.5 79.5,31.5 79.5,-4.5 -32.5,-4.5
GND on Bottom Layer: -29.5,28.49 82.5,28.49 82.5,-7.51 -29.5,-7.51
GND on Inner1: -26.5,25.49 85.5,25.49 85.5,-10.51 -26.5,-10.51
GND on Inner2: -23.5,22.49 88.5,22.49 88.5,-13.51 -23.5,-13.51
VBAT on Top Layer: 4.6,11.4 16.84,11.4 16.84,2.5 4.6,2.5
VBAT on Bottom Layer: 10.3,9.6 16.8,9.6 16.8,0.3 10.3,0.3
VBUS1 on Top Layer: 26.11,14.9 35.08,14.9 35.08,9 26.11,9
VBUS2 on Top Layer: 25.61,14.9 50.22,14.9 50.22,1.45 25.61,1.45
BAT- on Bottom Layer: 35.8,0.2 35.8,10.05 35.55,10.3 31.17,10.3 30.7,9.83 30.7,5.9 30.2,5.4 29.54,5.4 29.02,4.87 29.02,0.2
BST on Top Layer: 22,5.79 23.9,5.79 23.9,4.9 22,4.9
LX on Top Layer: 18.24,9.47 23.9,9.47 23.9,3.35 18.24,3.35
VSYS on Top Layer: 22.7,12.4 25.7,12.4 25.7,9 22.7,9
VSYS on Top Layer: 22.95,4.66 25.39,4.66 25.39,1.45 22.95,1.45
VSYS on Bottom Layer: 21.53,12.4 25.7,12.4 25.7,1.45 21.53,1.45

Small or netless copper shapes (teardrops, artwork), in the pictures only: 68 on Top Layer, 22 on Bottom Layer
